# Altium schematic sheet Sheet2.SchDoc
size A; SheetNumber: 1; SheetTotal: 1
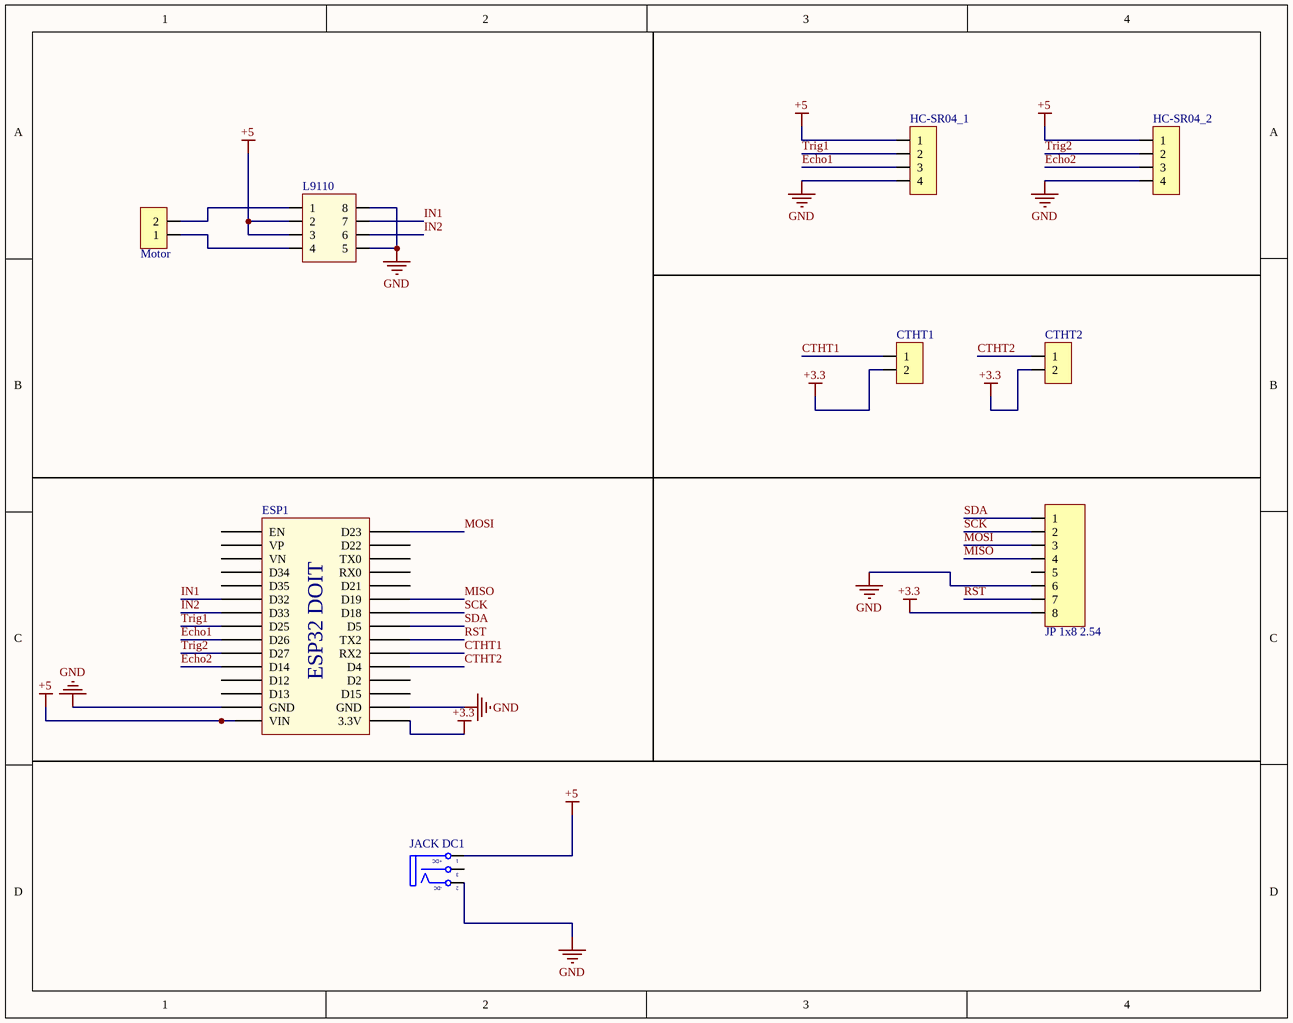
[diagram p0: Sheet2.SchDoc]

## Parts
CTHT1  CTHT1  [JP 1x2 DT]  (value not drawn)
CTHT2  CTHT2  [JP 1x2 DT]  (value not drawn)
ESP1  ESP32 DEVKIT  [ESP32 WROOM 32 KIT]  (value not drawn)
HC-SR04_1  HC-SR04_1  [JP 1x4 DT]  (value not drawn)
HC-SR04_2  HC-SR04_2  [JP 1x4 DT]  (value not drawn)
JACK_DC1  JACK DC 5.5  [JACK DC 5.5]  (value not drawn)
JP?  JP 1x8 2.54  [JP 1x8 DT]
L9110  DIP8  [DIP8/W0.3]  (value not drawn)
Motor  Motor  [JP 1x2 DT]  (value not drawn)

## Nets
+3.3: CTHT1.2 CTHT2.2 ESP1.16(3.3V) JP?.8
+5: ESP1.15(VIN) HC-SR04_1.1 HC-SR04_2.1 JACK_DC1.1(T) L9110.2 L9110.3
GND: ESP1.14(GND) ESP1.17(GND) HC-SR04_1.4 HC-SR04_2.4 JACK_DC1.2(TN) JP?.6 L9110.5 L9110.8
CTHT1: CTHT1.1 ESP1.21(RX2)
CTHT2: CTHT2.1 ESP1.20(D4)
Echo1: ESP1.9(D26) HC-SR04_1.3
Echo2: ESP1.11(D14) HC-SR04_2.3
IN1: ESP1.6(D32) L9110.7
IN2: ESP1.7(D33) L9110.6
MISO: ESP1.25(D19) JP?.4
MOSI: ESP1.30(D23) JP?.3
RST: ESP1.22(TX2) JP?.7
SCK: ESP1.24(D18) JP?.2
SDA: ESP1.23(D5) JP?.1
Trig1: ESP1.8(D25) HC-SR04_1.2
Trig2: ESP1.10(D27) HC-SR04_2.2
NetL9110_1: L9110.1 Motor.2
NetL9110_4: L9110.4 Motor.1

Not connected (* = marked no-connect by the designer): ESP1 1(EN) 2(VP) 3(VN) 4(D34) 5(D35) 12(D12) 13(D13) 18(D15) 19(D2) 26(D21) 27(RX0) 28(TX0) 29(D22); JACK_DC1 3(S); JP? 5

## Notes on the sheet
- (in symbol ESP32 WROOM 32 KIT) ESP32 DOIT
- (in symbol JACK DC 5.5) +DC; -DC

## Library data of the parts
CTHT1 CTHT2 Motor = JP 1x2 2.54 Duc Thang: Cắm; Ten_Linh_Kien: Jump Đơn Đực 2.54MM 1x40P Thẳng 11MM; Don_Vi: Con; Ma_Hang: MH000903; Ghi_Chu: *; Kieu_Chan: *; Chung_Loai: Cắm
ESP1 = ESP32 WROOM 32 KIT
HC-SR04_1 HC-SR04_2 = JP 1x4 2.54 Duc Thang: Cắm; Ten_Linh_Kien: Jump Đơn Đực 2.54MM 1x40P Thẳng 11MM; Don_Vi: Con; Ma_Hang: MH000903; Ghi_Chu: *; Kieu_Chan: *; Chung_Loai: Cắm
JACK_DC1 = JACK DC 5.5: Value: Jac DC
JP? = JP 1x8 2.54 Duc Thang: Cắm; Ten_Linh_Kien: Jump Đơn Đực 2.54MM 1x40P Thẳng 11MM; Don_Vi: Con; Ma_Hang: MH000903; Ghi_Chu: *; Kieu_Chan: *; Chung_Loai: Cắm
L9110 = DIP8: Value: DIP8